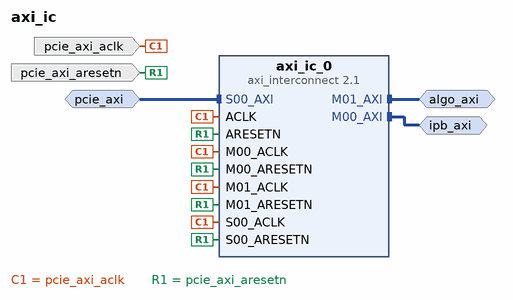
[diagram p0: block diagram of the top level]
# Vivado block design axi_ic, xcvu7p-flvb2104-1-e, Vivado 2019.2
create_bd_design axi_ic

create_bd_intf_port -mode Slave -vlnv xilinx.com:interface:aximm_rtl:1.0 pcie_axi
set_property -dict [list \
  CONFIG.DATA_WIDTH 64 \
  CONFIG.PROTOCOL AXI4 \
  CONFIG.FREQ_HZ 125000000 \
  CONFIG.ID_WIDTH 0 \
  CONFIG.ADDR_WIDTH 64 \
  CONFIG.AWUSER_WIDTH 0 \
  CONFIG.ARUSER_WIDTH 0 \
  CONFIG.WUSER_WIDTH 0 \
  CONFIG.RUSER_WIDTH 0 \
  CONFIG.BUSER_WIDTH 0 \
  CONFIG.READ_WRITE_MODE READ_WRITE \
  CONFIG.HAS_BURST 1 \
  CONFIG.HAS_LOCK 1 \
  CONFIG.HAS_PROT 1 \
  CONFIG.HAS_CACHE 1 \
  CONFIG.HAS_QOS 1 \
  CONFIG.HAS_REGION 0 \
  CONFIG.HAS_WSTRB 1 \
  CONFIG.HAS_BRESP 1 \
  CONFIG.HAS_RRESP 1 \
  CONFIG.SUPPORTS_NARROW_BURST 1 \
  CONFIG.NUM_READ_OUTSTANDING 2 \
  CONFIG.NUM_WRITE_OUTSTANDING 2 \
  CONFIG.MAX_BURST_LENGTH 256 \
  CONFIG.NUM_READ_THREADS 1 \
  CONFIG.NUM_WRITE_THREADS 1 \
  CONFIG.RUSER_BITS_PER_BYTE 0 \
  CONFIG.WUSER_BITS_PER_BYTE 0 \
] [get_bd_intf_ports pcie_axi]
create_bd_intf_port -mode Master -vlnv xilinx.com:interface:aximm_rtl:1.0 ipb_axi
set_property -dict [list \
  CONFIG.DATA_WIDTH 64 \
  CONFIG.PROTOCOL AXI4 \
  CONFIG.FREQ_HZ 125000000 \
  CONFIG.ADDR_WIDTH 64 \
  CONFIG.HAS_QOS 0 \
  CONFIG.HAS_REGION 0 \
  CONFIG.NUM_READ_OUTSTANDING 2 \
  CONFIG.NUM_WRITE_OUTSTANDING 2 \
] [get_bd_intf_ports ipb_axi]
create_bd_intf_port -mode Master -vlnv xilinx.com:interface:aximm_rtl:1.0 algo_axi
set_property -dict [list \
  CONFIG.DATA_WIDTH 64 \
  CONFIG.PROTOCOL AXI4 \
  CONFIG.FREQ_HZ 125000000 \
  CONFIG.ADDR_WIDTH 64 \
  CONFIG.HAS_QOS 0 \
  CONFIG.HAS_REGION 0 \
  CONFIG.NUM_READ_OUTSTANDING 2 \
  CONFIG.NUM_WRITE_OUTSTANDING 2 \
] [get_bd_intf_ports algo_axi]
create_bd_port -dir I -type clk pcie_axi_aclk
set_property -dict [list \
  CONFIG.ASSOCIATED_BUSIF pcie_axi:ipb_axi:algo_axi \
  CONFIG.ASSOCIATED_RESET S_ARESETN:pcie_axi_aresetn \
  CONFIG.FREQ_HZ 125000000 \
] [get_bd_ports pcie_axi_aclk]
create_bd_port -dir I -type rst pcie_axi_aresetn

create_bd_cell -type ip -vlnv xilinx.com:ip:axi_interconnect:2.1 axi_ic_0

# ---- connections ----

connect_bd_intf_net -intf_net S00_AXI_0_1 [get_bd_intf_ports pcie_axi] [get_bd_intf_pins axi_ic_0/S00_AXI]
connect_bd_intf_net -intf_net axi_interconnect_0_M00_AXI [get_bd_intf_ports ipb_axi] [get_bd_intf_pins axi_ic_0/M00_AXI]
connect_bd_intf_net -intf_net axi_interconnect_0_M01_AXI [get_bd_intf_ports algo_axi] [get_bd_intf_pins axi_ic_0/M01_AXI]
connect_bd_net -net ACLK_0_1 [get_bd_ports pcie_axi_aclk] \
  [get_bd_pins axi_ic_0/ACLK] [get_bd_pins axi_ic_0/S00_ACLK] [get_bd_pins axi_ic_0/M00_ACLK] [get_bd_pins axi_ic_0/M01_ACLK]
connect_bd_net -net ARESETN_0_1 [get_bd_ports pcie_axi_aresetn] \
  [get_bd_pins axi_ic_0/ARESETN] [get_bd_pins axi_ic_0/S00_ARESETN] [get_bd_pins axi_ic_0/M00_ARESETN] \
  [get_bd_pins axi_ic_0/M01_ARESETN]

# ---- address map ----
assign_bd_address -offset 0x0000000000000000 -range 128M -target_address_space [get_bd_addr_spaces pcie_axi] [get_bd_addr_segs ipb_axi/Reg]
assign_bd_address -offset 0x0000000008000000 -range 128M -target_address_space [get_bd_addr_spaces pcie_axi] [get_bd_addr_segs algo_axi/Reg]

validate_bd_design
save_bd_design
